# EasyEDA Pro project Schema Circuit PIA.epro

# Schematic Schematic1
Create Date: 2024-04-15; Page Name: P1; Project Name: PIA 2024; Schematic Name: Schematic1; Update Date: 2024-04-15; Add into BOM: yes; Convert to PCB: yes
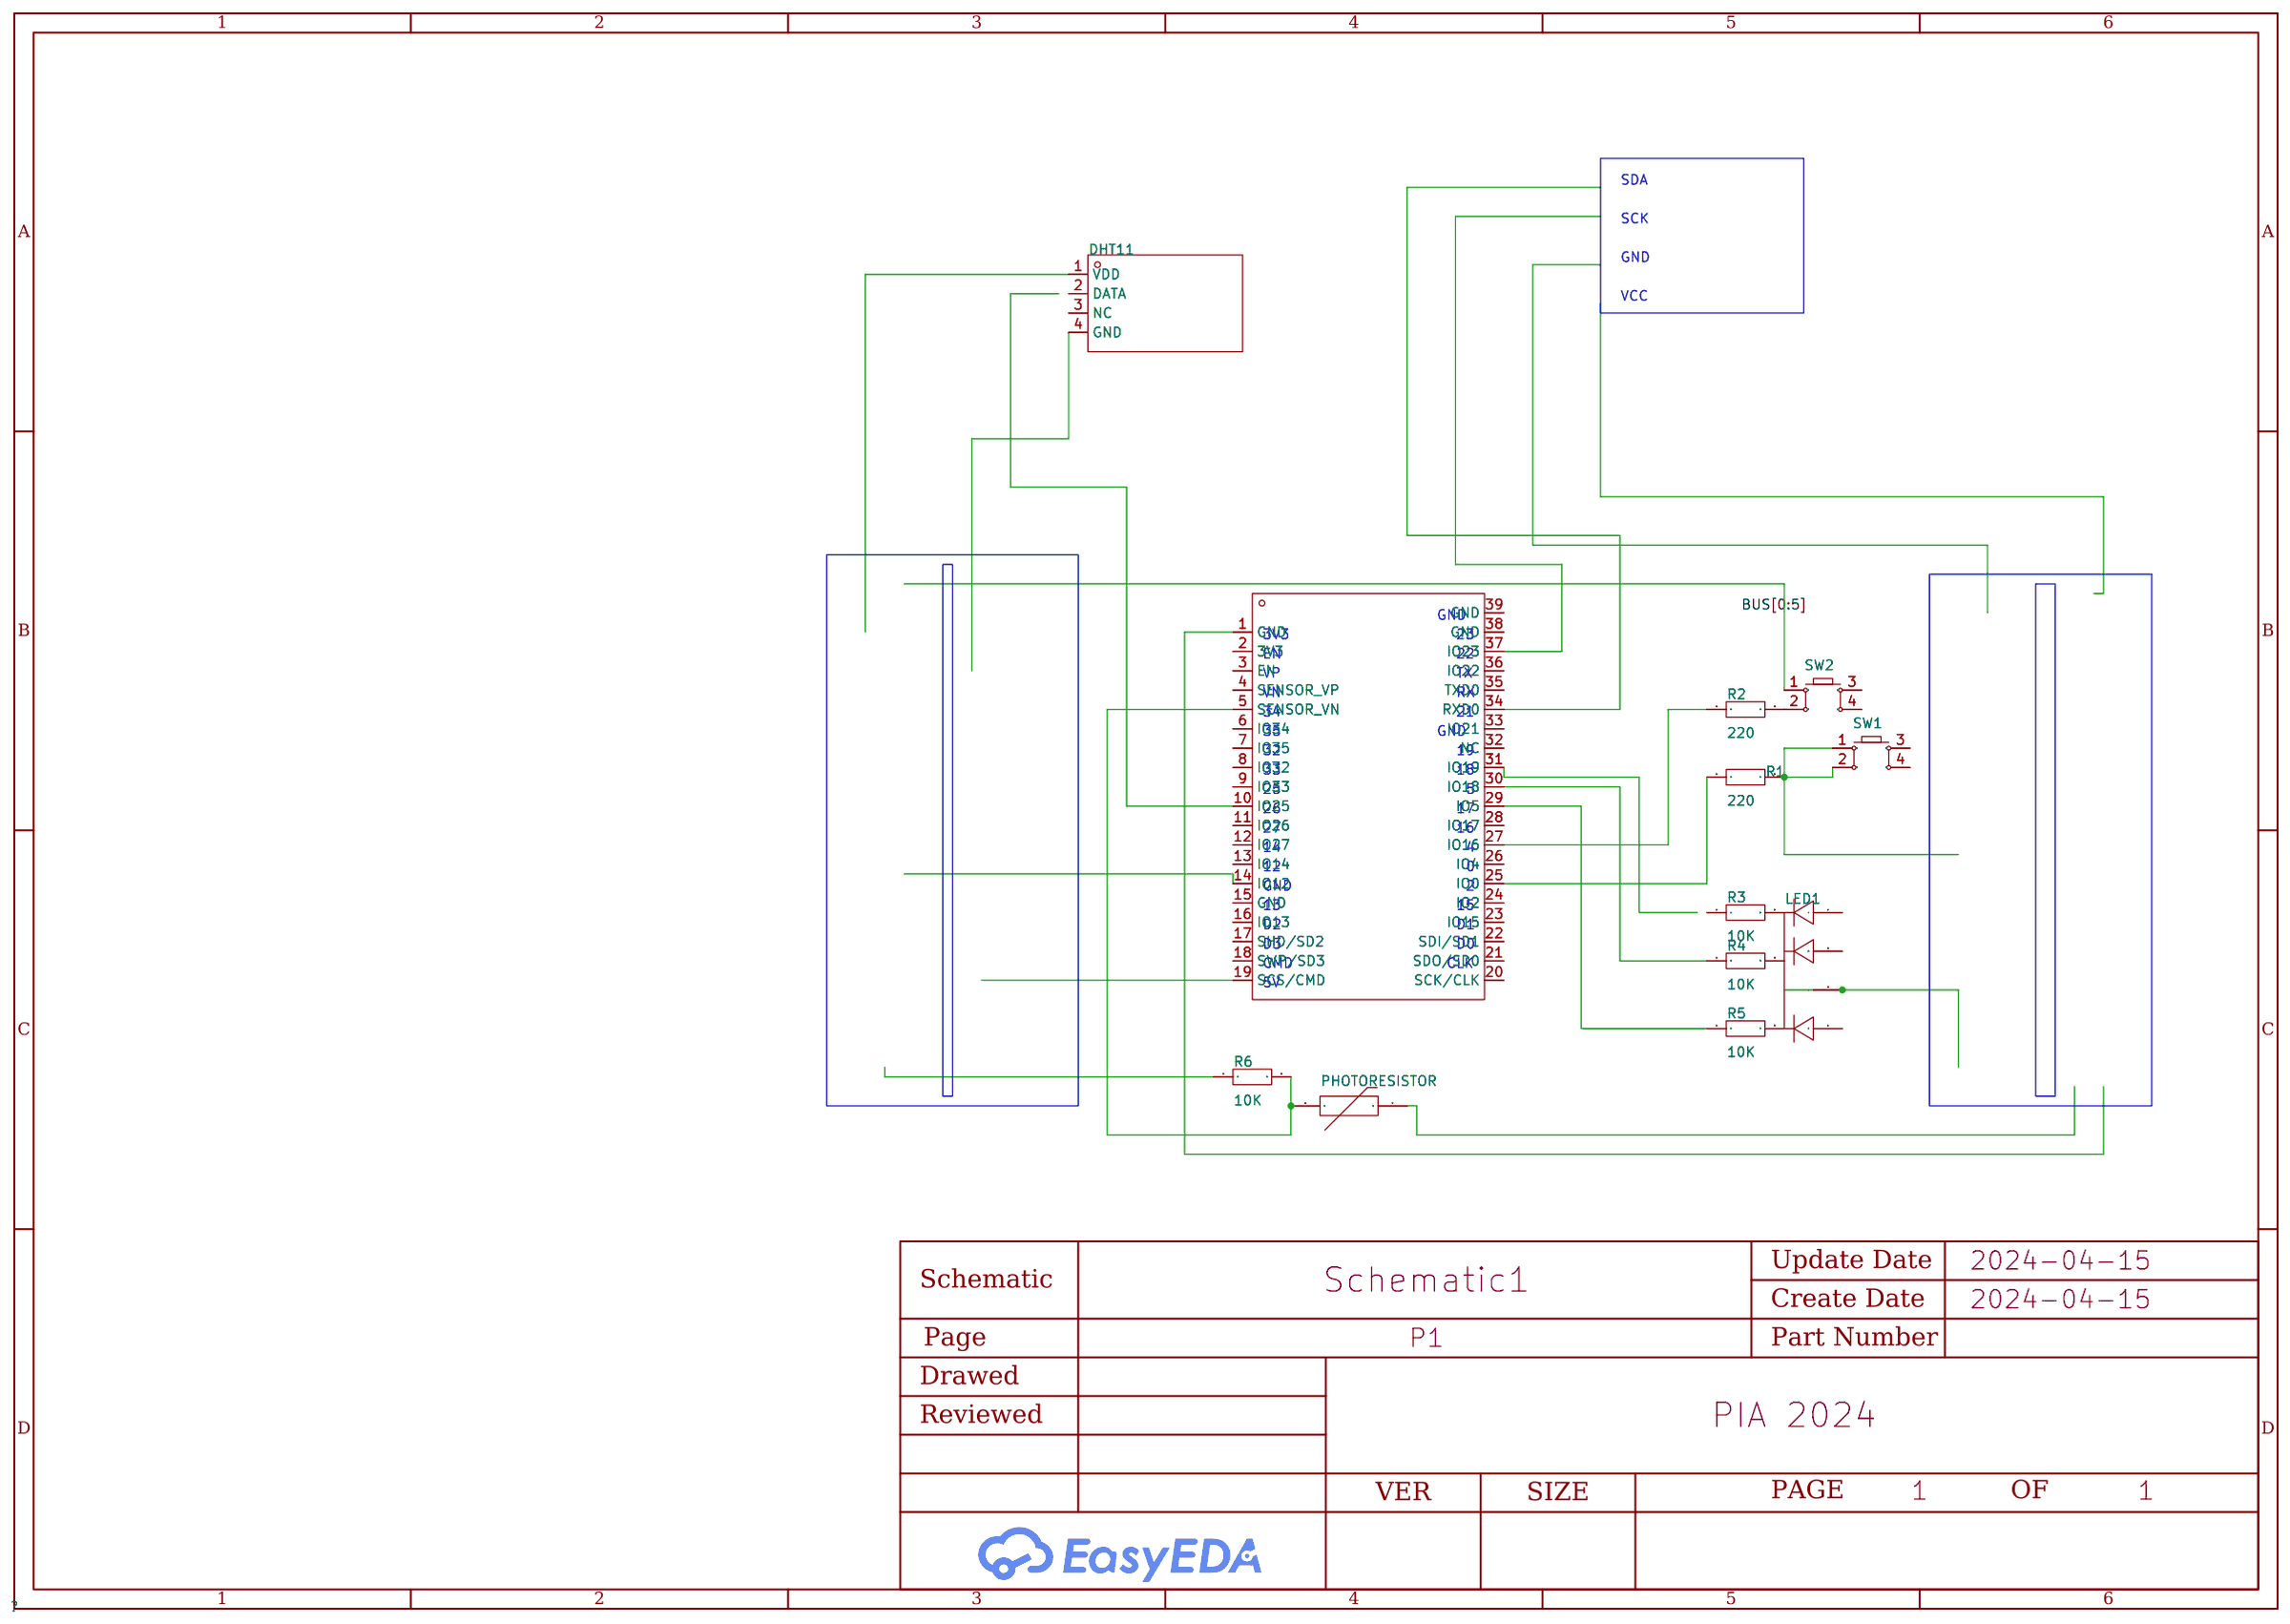
[diagram p0: schematic sheet]

## Parts
DHT11  -  [SENSOR-TH_DHT11]
LED1  -  [LED-TH_4P-BD5.8-P1.30]
PHOTORESISTOR  -  [RES-TH_L17.5-W6.0-P7.50-D0.8-S5.20]
R1  220  [R0603]
R2  220  [R0603]
R3  10K  [R0603]
R4  10K  [R0603]
R5  10K  [R0603]
R6  10K  [R0603]
SW1  -  [KEY-TH_4P-L6.0-W6.0-P3.90-LS6.5]
SW2  -  [KEY-TH_4P-L6.0-W6.0-P3.90-LS6.5]
U1  -  [WIFIM-SMD_ESP-32S]

## Library data of the parts
DHT11 = DHT11: Sensor Type: Output Type: Temperature Range: Humidity Range: Response Time: Accuracy: Voltage-Supply: Operating Temperature:; LCSC Part Name: DHT11  电容式传感器; Supplier Part: C117051; Manufacturer: 广州奥松; Supplier Footprint: 16.1mm*12.6mm*5.8mm; JLCPCB Part Class: Extended Part; Datasheet: https://atta.szlcsc.com/upload/public/pdf/source/20170703/1499081238365.pdf; Supplier: LCSC
LED1 = TJ-L5FYTXHMCSLCRGB-A5: Emitted Color:RGB; LCSC Part Name: RGB三色; Supplier Part: C330759; Manufacturer: TOGIALED(台湾统佳); Supplier Footprint: 插件,D=5mm; JLCPCB Part Class: Extended Part; Datasheet: https://atta.szlcsc.com/upload/public/pdf/source/20181220/C330759_95C409BF14EF1DFA3353C5A3EA3A53E5.pdf; Supplier: LCSC; Emitted Color: RGB
PHOTORESISTOR = MF72 5D15: Resistance @ 25℃: Resistance Tolerance: B Constant Tolerance: B Constant (25℃/50℃): Power: Steady State Current (Max):6A B Constant (25℃/75℃):- B Constant (25℃/85℃):- B Constant (25℃/100℃):- Operating Temperature:-40℃~+200℃ Operating Temperature:-40℃~+200℃; LCSC Part Name: 5Ω 电阻精度:±20% 3000K 功率型NTC; Supplier Part: C72690; Manufacturer: 时恒; Supplier Footprint: 径向引线,P=7.5mm; JLCPCB Part Class: Extended Part; Datasheet: https://atta.szlcsc.com/upload/public/pdf/source/20160507/1462613615903.pdf; Supplier: LCSC; Steady State Current (Max): 6A; Operating Temperature: -40℃~+200℃
R1-R6 = Res_0603: Supplier Footprint: 0603
SW1 SW2 = Key_TH_6x6x4.5: Circuit:SPST Mounting Style:Straight Actuator Style:Round Button Actuator/Cap Color:Black Operating Force:250gf@±30gf Pin Style:PCPin Switch Length:6mm Switch Width:6mm Switch Height:4.5mm Strike Gundam:NO; Supplier Part: C2834896; Supplier Footprint: 插件; Circuit: SPST; Mounting Style: Straight; Actuator Style: Round Button; Actuator/Cap Color: Black; Operating Force: 250gf@±30gf; Pin Style: PCPin; Switch Length: 6mm; Switch Width: 6mm; Switch Height: 4.5mm; Strike Gundam: NO
U1 = ESP32-WROOM-32: Supplier Part: C82899; Manufacturer: ESPRESSIF(乐鑫); Supplier Footprint: WIFI无线 Module; JLCPCB Part Class: Extended Part; Datasheet: https://atta.szlcsc.com/upload/public/pdf/source/20210719/C82899_2D52724B6FAFABC419BCF308C5944296.pdf; Supplier: LCSC

## Nets
Net-(PHOTORESISTOR-2): PHOTORESISTOR.2 R6.2 U1.5(SENSOR_VN)
Net-(R1-1): R1.1 U1.25(IO0)
Net-(R1-2): R1.2 SW1.1 SW1.2
Net-(R2-1): R2.1 U1.27(IO16)
Net-(R2-2): R2.2 SW2.2
Net-(R4-1): R4.1 U1.30(IO18)
Net-(R5-1): R5.1 U1.29(IO5)

Not connected (* = marked no-connect by the designer): DHT11 1(VDD) 2(DATA) 3(NC) 4(GND); LED1 1 2(-) 3 4; PHOTORESISTOR 1; R3 1 2; R4 2; R5 2; R6 1; SW1 3 4; SW2 1 3 4; U1 1(GND) 2(3V3) 3(EN) 4(SENSOR_VP) 6(IO34) 7(IO35) 8(IO32) 9(IO33) 10(IO25) 11(IO26) 12(IO27) 13(IO14) 14(IO12) 15(GND) 16(IO13) 17(SHD/SD2) 18(SWP/SD3) 19(SCS/CMD) 20(SCK/CLK) 21(SDO/SD0) 22(SDI/SD1) 23(IO15) 24(IO2) 26(IO4) 28(IO17) 31(IO19) 32(NC) 33(IO21) 34(RXD0) 35(TXD0) 36(IO22) 37(IO23) 38(GND) 39(GND)

## Notes on the sheet
- SDA
- SCK
- GND
- VCC
- GND
- 3V3
- EN
- 22
- 23
- VP
- TX
- VN
- RX
- 34
- 21
- 35
- GND
- 32
- 33
- 18
- 19
- 25
- 5
- 26
- 17
- 27
- 16
- 14
- 4
- 12
- 0
- 13
- GND
- 15
- 2
- D2
- D1
- D3
- D0
- CMD
- CLK
- 5V
